# EAGLE design display (EAGLE 7.7.0)
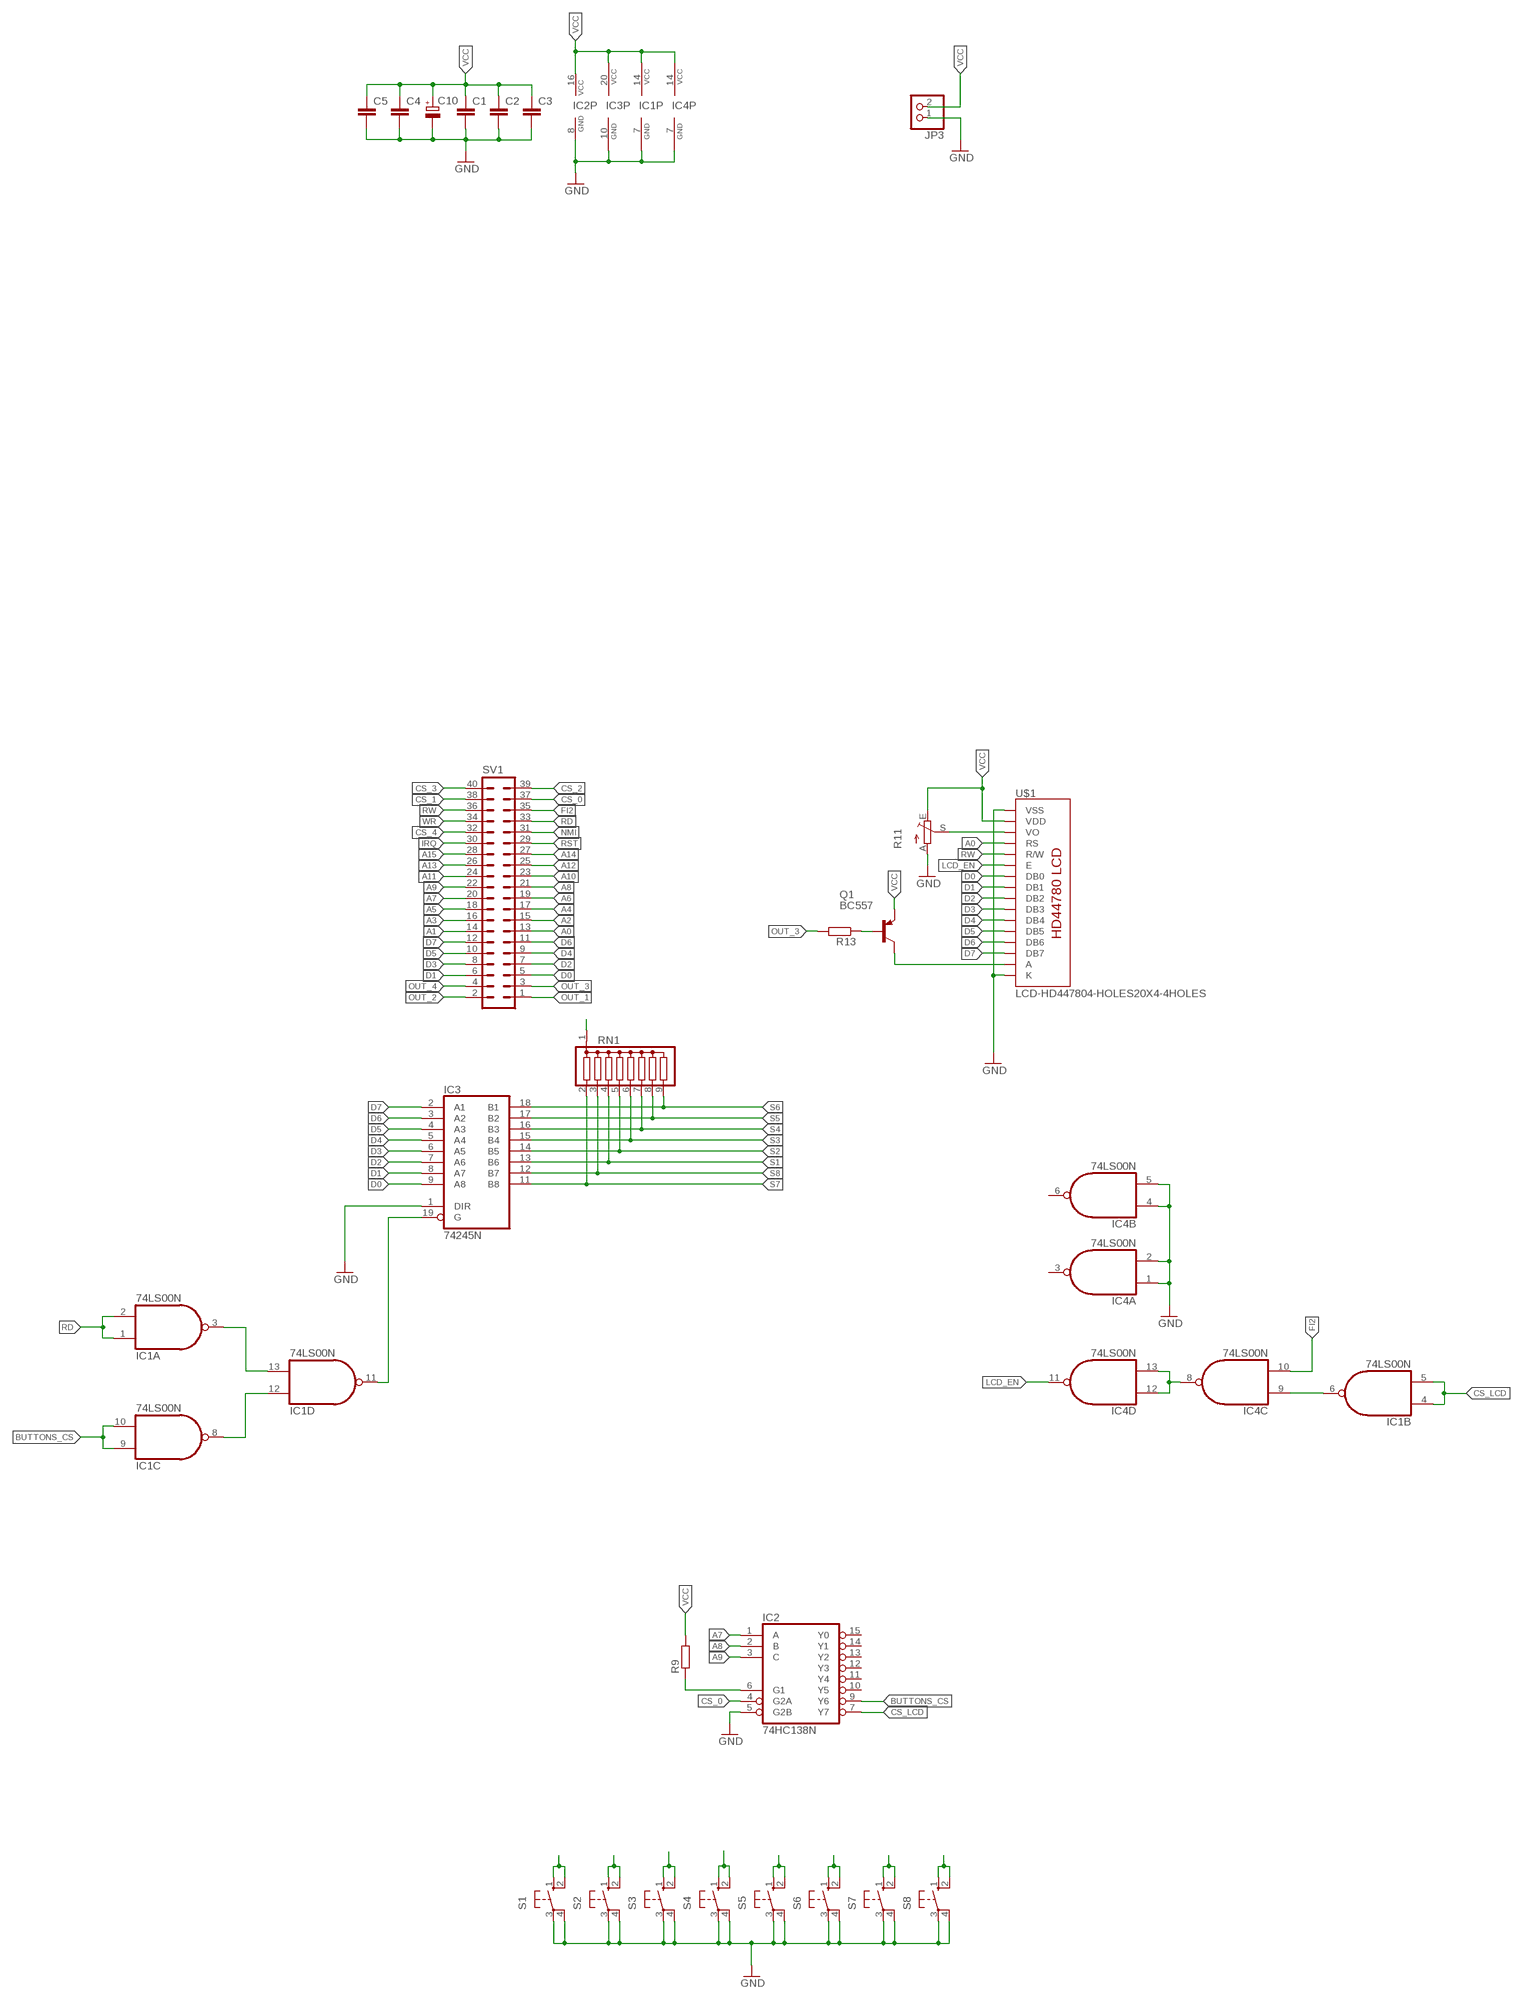
[diagram p0: schematic, sheet 1]

## Parts
C1  C-EUC0603  [C0603]
C2  C-EUC1206  [C1206]
C3  C-EUC1206  [C1206]
C4  C-EUC1206  [C1206]
C5  C-EUC1206  [C1206]
C10  CPOL-EUE5-10.5  [E5-10,5]
IC1  74LS00N  [DIL14]
IC2  74HC138N  [DIL16]
IC3  74245N  74LS245N  [DIL20]
IC4  74LS00N  [DIL14]
JP3  PINHD-1X2/90  [1X02/90]
Q1  BC557  [TO92]
R9  R-EU_0204/7  [0204/7]
R11  TRIM_EU-B25U  [B25U]
R13  R-EU_0204/7  [0204/7]
RN1  G08R  [SIL9]
S1  40-XX  [B3F-40XX]
S2  40-XX  [B3F-40XX]
S3  40-XX  [B3F-40XX]
S4  40-XX  [B3F-40XX]
S5  40-XX  [B3F-40XX]
S6  40-XX  [B3F-40XX]
S7  40-XX  [B3F-40XX]
S8  40-XX  [B3F-40XX]
SV1  ML40L  [ML40L]
U$1  LCD-HD447804-HOLES20X4-4HOLES  [LCD-20X4-4HOLES]

## Nets
A0: SV1.13 U$1.P$4(RS)
A1: SV1.14
A2: SV1.15
A3: SV1.16
A4: SV1.17
A5: SV1.18
A6: SV1.19
A7: IC2.1(A) SV1.20
A8: IC2.2(B) SV1.21
A9: IC2.3(C) SV1.22
A10: SV1.23
A11: SV1.24
A12: SV1.25
A13: SV1.26
A14: SV1.27
A15: SV1.28
BUTTONS_CS: IC1.9(C:I0) IC1.10(C:I1) IC2.9(Y6)
CS_0: IC2.4(G2A) SV1.37
CS_1: SV1.38
CS_2: SV1.39
CS_3: SV1.40
CS_4: SV1.32
CS_LCD: IC1.4(B:I0) IC1.5(B:I1) IC2.7(Y7)
D0: IC3.9(A8) SV1.5 U$1.P$7(DB0)
D1: IC3.8(A7) SV1.6 U$1.P$8(DB1)
D2: IC3.7(A6) SV1.7 U$1.P$9(DB2)
D3: IC3.6(A5) SV1.8 U$1.P$10(DB3)
D4: IC3.5(A4) SV1.9 U$1.P$11(DB4)
D5: IC3.4(A3) SV1.10 U$1.P$12(DB5)
D6: IC3.3(A2) SV1.11 U$1.P$13(DB6)
D7: IC3.2(A1) SV1.12 U$1.P$14(DB7)
FI2: IC4.10(C:I1) SV1.35
GND: C1.2 C2.2 C3.2 C4.2 C5.2 C10.- IC1.7(P:GND) IC2.5(G2B) IC2.8(GND) IC3.1(DIR) IC3.10(GND) IC4.1(A:I0) IC4.2(A:I1) IC4.4(B:I0) IC4.5(B:I1) IC4.7(P:GND) JP3.1 R11.A S1.3(P) S1.4(P1) S2.3(P) S2.4(P1) S3.3(P) S3.4(P1) S4.3(P) S4.4(P1) S5.3(P) S5.4(P1) S6.3(P) S6.4(P1) S7.3(P) S7.4(P1) S8.3(P) S8.4(P1) U$1.P$1(VSS) U$1.P$16(K)
IRQ: SV1.30
LCD_EN: IC4.11(D:O) U$1.P$6(E)
N$1: IC1.11(D:O) IC3.19(G)
N$3: Q1.3(C) U$1.P$15(A)
N$4: IC4.8(C:O) IC4.12(D:I0) IC4.13(D:I1)
N$5: IC1.6(B:O) IC4.9(C:I0)
N$6: Q1.2(B) R13.1
N$10: IC1.3(A:O) IC1.13(D:I1)
N$11: IC1.8(C:O) IC1.12(D:I0)
N$12: IC2.6(G1) R9.1
N$14: R11.S U$1.P$3(VO)
NMI: SV1.31
OUT_1: SV1.1
OUT_2: SV1.2
OUT_3: R13.2 SV1.3
OUT_4: SV1.4
RD: IC1.1(A:I0) IC1.2(A:I1) SV1.33
RST: SV1.29
RW: SV1.36 U$1.P$5(R/W)
S1: IC3.13(B6) RN1.4 S1.1(S) S1.2(S1)
S2: IC3.14(B5) RN1.5 S2.1(S) S2.2(S1)
S3: IC3.15(B4) RN1.6 S3.1(S) S3.2(S1)
S4: IC3.16(B3) RN1.7 S4.1(S) S4.2(S1)
S5: IC3.17(B2) RN1.8 S5.1(S) S5.2(S1)
S6: IC3.18(B1) RN1.9 S6.1(S) S6.2(S1)
S7: IC3.11(B8) RN1.2 S7.1(S) S7.2(S1)
S8: IC3.12(B7) RN1.3 S8.1(S) S8.2(S1)
VCC: C1.1 C2.1 C3.1 C4.1 C5.1 C10.+ IC1.14(P:VCC) IC2.16(VCC) IC3.20(VCC) IC4.14(P:VCC) JP3.2 Q1.1(E) R9.2 R11.E RN1.1 U$1.P$2(VDD)
WR: SV1.34
Unconnected: IC2.10(Y5) IC2.11(Y4) IC2.12(Y3) IC2.13(Y2) IC2.14(Y1) IC2.15(Y0) IC4.3(A:O) IC4.6(B:O)

## Library data of the parts
C1-C5 = rcl:C-EU: CAPACITOR, European symbol
C10 = rcl:CPOL-EU: POLARIZED CAPACITOR, European symbol
IC1 IC4 = 74xx-us:74*00: Quad 2-input NAND gate
IC2 = 74xx-eu:74*138: 3-line to 8-line DECODER/DEMULTIPLEXER
IC3 = 74xx-us:74*245: Octal BUS TRANSCEIVER, 3-state
JP3 = pinhead:PINHD-1X2: PIN HEADER
Q1 = transistor-pnp:BC557: PNP Transistor
R9 R13 = rcl:R-EU_: RESISTOR, European symbol
R11 = pot:TRIM_EU-: POTENTIOMETER
RN1 = resistor-sil:G08R: SIL RESISTOR; OC_FARNELL: unknown; OC_NEWARK: unknown
S1-S8 = switch-omron:40-XX: OMRON SWITCH; MF: OMRON COMPONENTS USA; MPN: B3F-4000; OC_FARNELL: 176434; OC_NEWARK: 36K3105
SV1 = con-harting-ml:ML40: HARTING; OC_FARNELL: unknown; OC_NEWARK: unknown
U$1 = HD44780LCD:LCD-HD44780

## Board
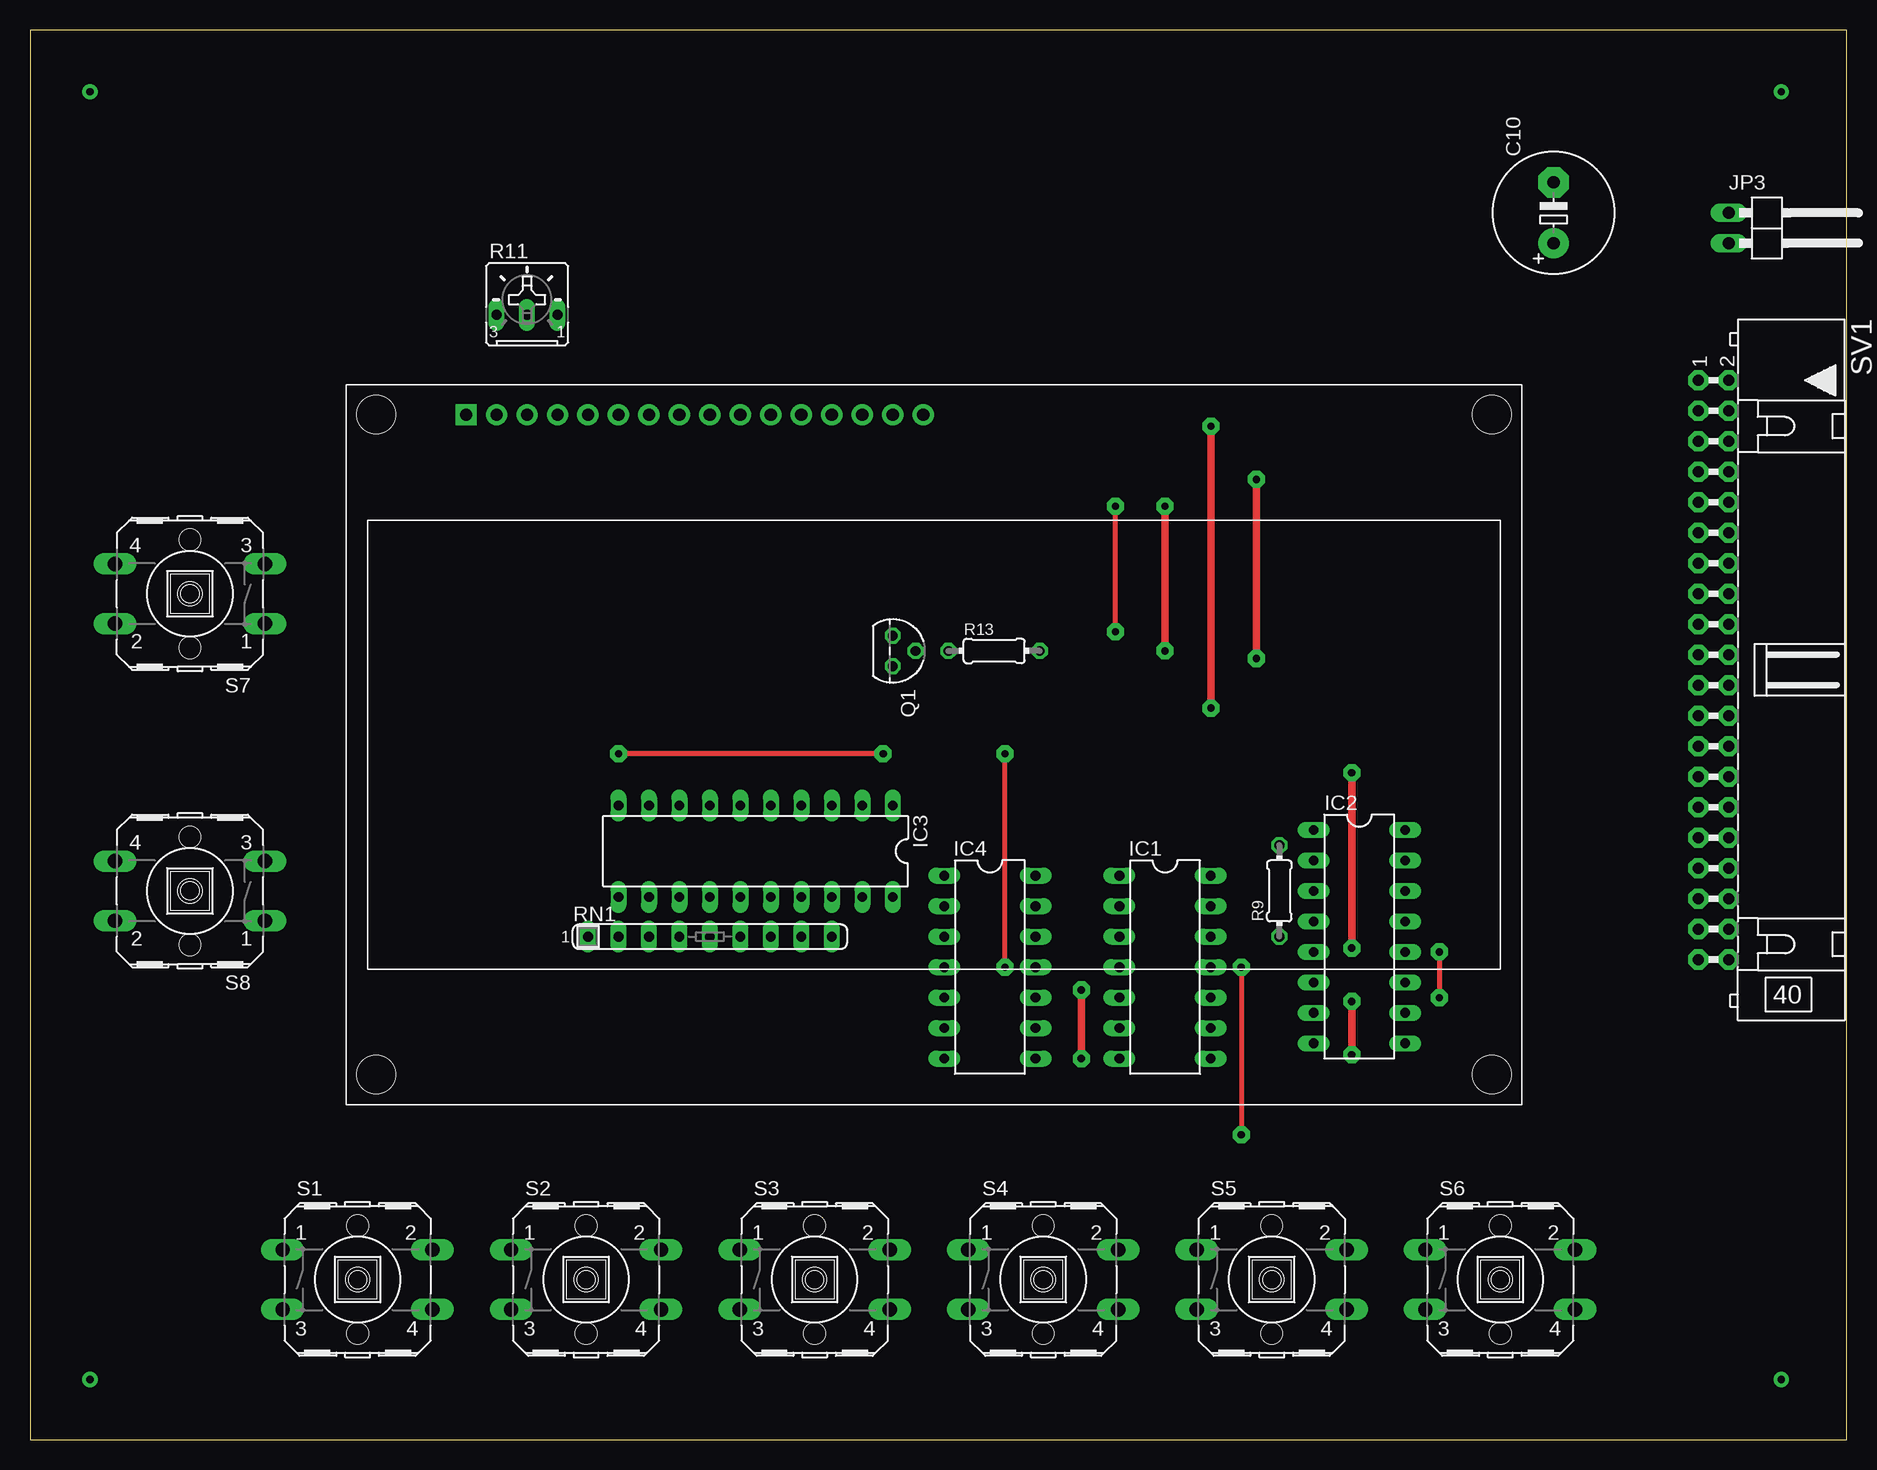
[diagram p1: board, top side]
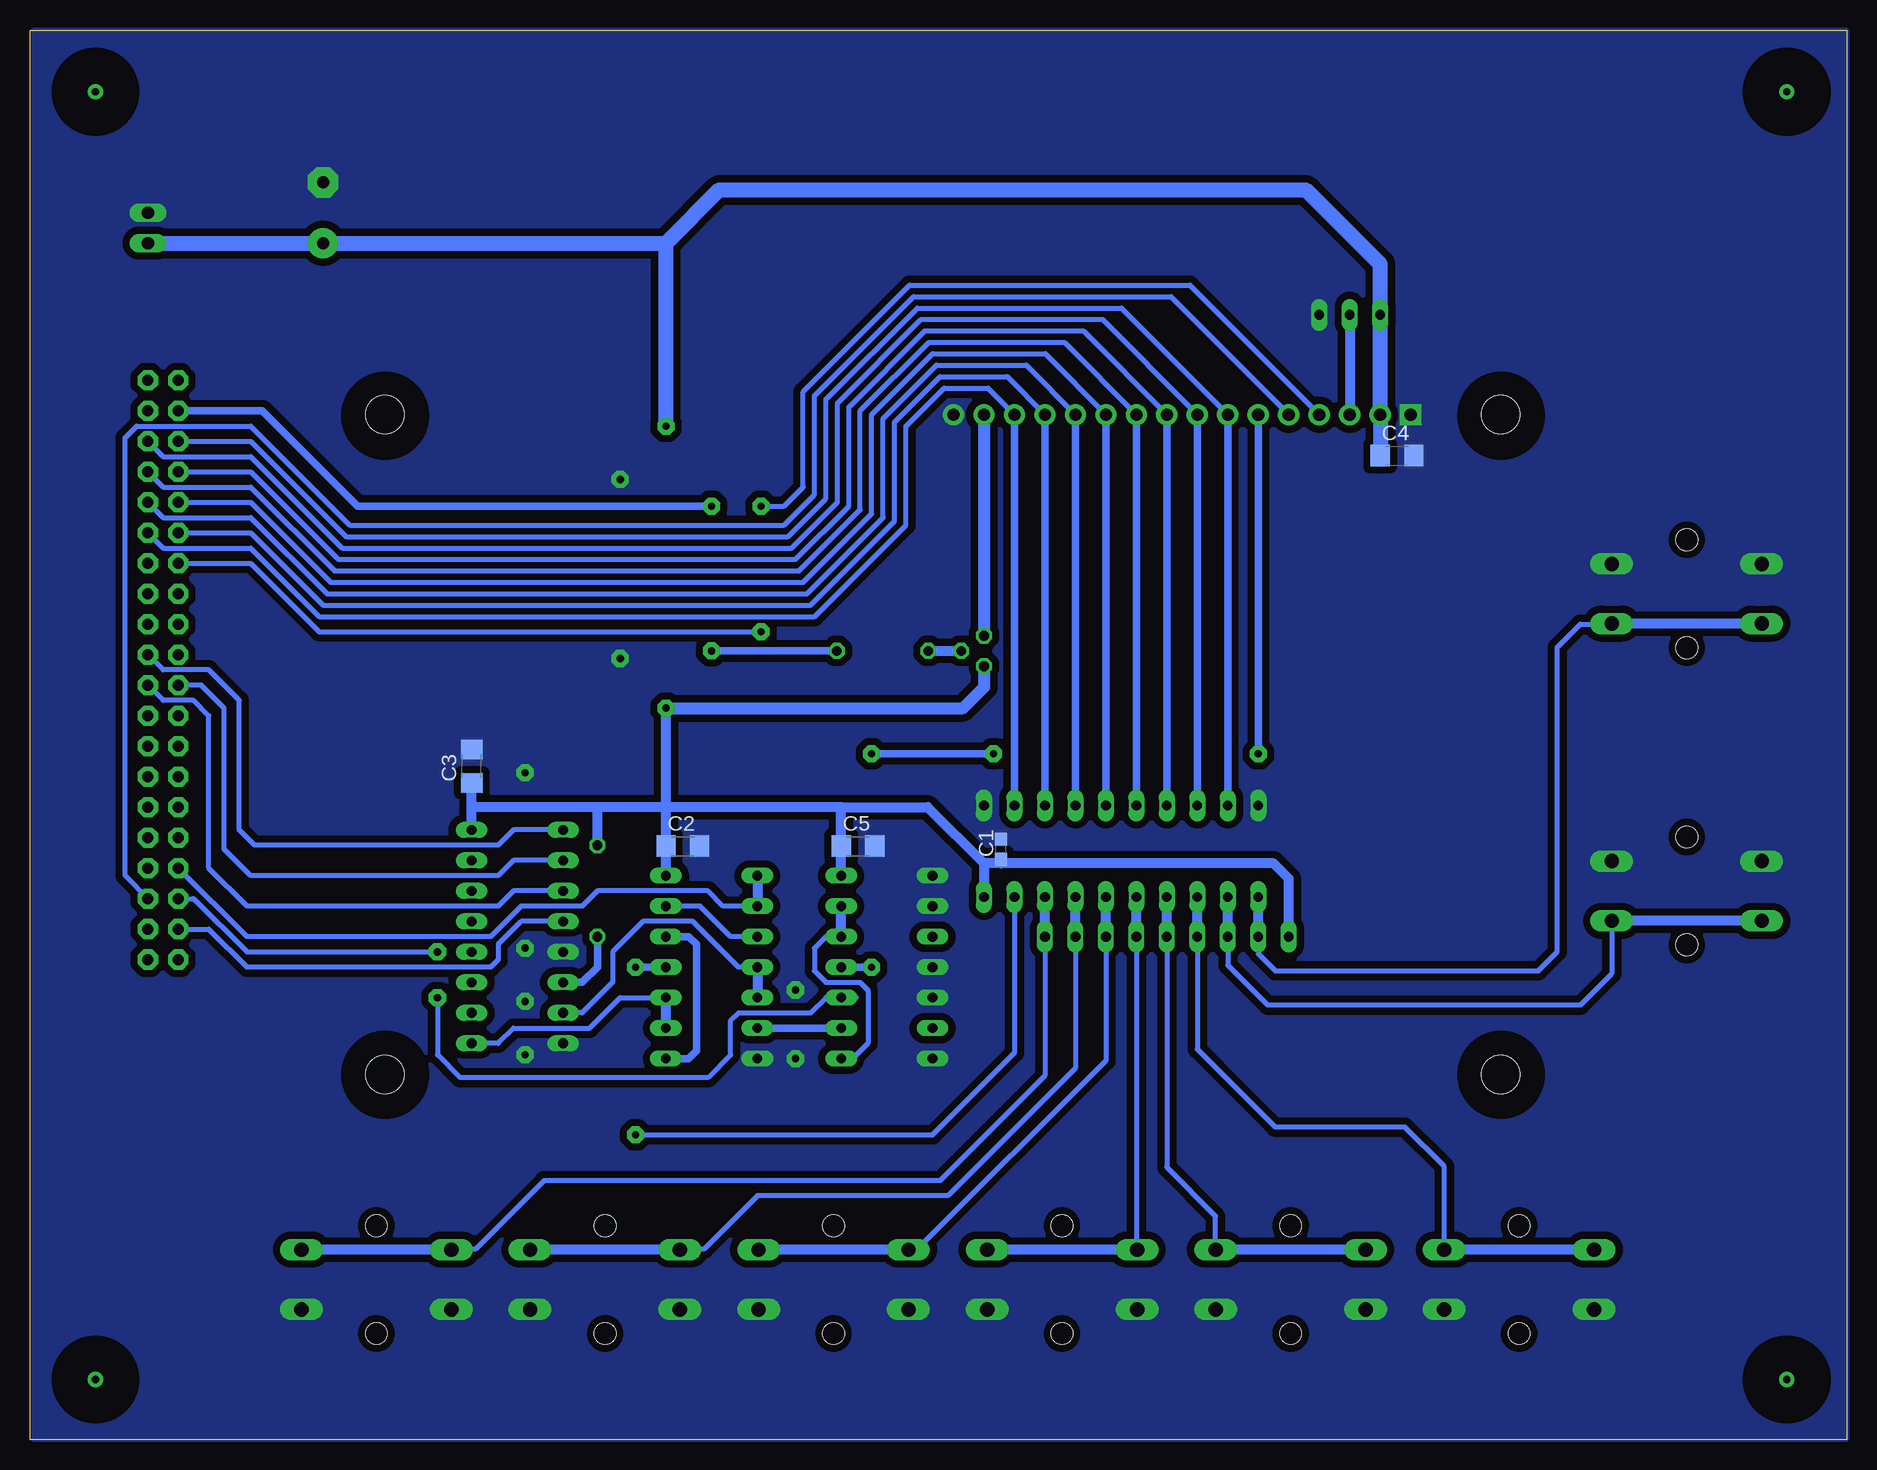
[diagram p2: board, bottom side, seen from below]

Size 151.44 x 117.47 mm. Coordinates in mm from the lower left corner, seen from the top.
Outline: 0,0 151.44,0 151.44,117.47 0,117.47 0,0
Copper layers (1*16): Top 0.035mm / dielectric 1.5mm / Bottom 0.035mm
Design rules "default *": minimum track width 10mil, minimum drill 24mil, track to track 8mil, track to pad 8mil, pad to pad 8mil, via to via 8mil, smd to smd 8mil, copper to edge 0mil, drill to drill 8mil, minimum pad ring 10mil, minimum via ring 8mil, stop-mask expansion 4mil, vias tented up to drill 0mil, thermal gap 10mil
bRestrict: area 2,2 to 8,8; area 2,109.3 to 8,115.4; area 142.9,2 to 149,8; area 142.9,109.3 to 149,115.4; area 25.8,27.4 to 31.9,33.4; area 118.8,27.4 to 124.9,33.4; area 118.8,82.3 to 124.9,88.4; area 25.8,82.3 to 31.9,88.4

### Footprints (pad centres in the part's own frame; a part is rotated, then mirrored left to right if it is on the bottom)
C0603 = smd 1.1 x 1: 1 -0.85,0; 2 0.85,0
C1206 = smd 1.6 x 1.8: 1 -1.4,0; 2 1.4,0
E5-10,5 = drill 1.016 pad 2.54: + -2.54,0 | drill 1.016 pad 2.54 octagon: - 2.54,0
DIL14 = drill 0.813 long: 1 -7.62,-3.81; 2 -5.08,-3.81; 3 -2.54,-3.81; 4 0,-3.81; 5 2.54,-3.81; 6 5.08,-3.81; 7 7.62,-3.81; 8 7.62,3.81; 9 5.08,3.81; 10 2.54,3.81; 11 0,3.81; 12 -2.54,3.81; 13 -5.08,3.81; 14 -7.62,3.81
DIL16 = drill 0.813 long: 1 -8.89,-3.81; 2 -6.35,-3.81; 3 -3.81,-3.81; 4 -1.27,-3.81; 5 1.27,-3.81; 6 3.81,-3.81; 7 6.35,-3.81; 8 8.89,-3.81; 9 8.89,3.81; 10 6.35,3.81; 11 3.81,3.81; 12 1.27,3.81; 13 -1.27,3.81; 14 -3.81,3.81; 15 -6.35,3.81; 16 -8.89,3.81
DIL20 = drill 0.813 long: 1 -11.43,-3.81; 2 -8.89,-3.81; 3 -6.35,-3.81; 4 -3.81,-3.81; 5 -1.27,-3.81; 6 1.27,-3.81; 7 3.81,-3.81; 8 6.35,-3.81; 9 8.89,-3.81; 10 11.43,-3.81; 11 11.43,3.81; 12 8.89,3.81; 13 6.35,3.81; 14 3.81,3.81; 15 1.27,3.81; 16 -1.27,3.81; 17 -3.81,3.81; 18 -6.35,3.81; 19 -8.89,3.81; 20 -11.43,3.81
1X02/90 = drill 1.016 long: 1 -1.27,-3.81; 2 1.27,-3.81
TO92 = drill 0.813 octagon: 1 1.27,0; 2 0,1.905; 3 -1.27,0
0204/7 = drill 0.813 octagon: 1 -3.81,0; 2 3.81,0
B25U = drill 0.813 long: A 2.54,-0.889; E -2.54,-0.889; S 0,-0.889
SIL9 = drill 0.813 long: 1 -10.16,0; 2 -7.62,0; 3 -5.08,0; 4 -2.54,0; 5 0,0; 6 2.54,0; 7 5.08,0; 8 7.62,0; 9 10.16,0
B3F-40XX = drill 1.194 long: 1 -6.248,2.489; 2 6.248,2.489; 3 -6.248,-2.489; 4 6.248,-2.489 | hole 1.803: 0,-4.496; 0,4.496
ML40L = drill 0.914 pad 1.676 octagon: 1 -24.13,-1.27; 2 -24.13,1.27; 3 -21.59,-1.27; 4 -21.59,1.27; 5 -19.05,-1.27; 6 -19.05,1.27; 7 -16.51,-1.27; 8 -16.51,1.27; 9 -13.97,-1.27; 10 -13.97,1.27; 11 -11.43,-1.27; 12 -11.43,1.27; 13 -8.89,-1.27; 14 -8.89,1.27; 15 -6.35,-1.27; 16 -6.35,1.27; 17 -3.81,-1.27; 18 -3.81,1.27; 19 -1.27,-1.27; 20 -1.27,1.27; 21 1.27,-1.27; 22 1.27,1.27; 23 3.81,-1.27; 24 3.81,1.27; 25 6.35,-1.27; 26 6.35,1.27; 27 8.89,-1.27; 28 8.89,1.27; 29 11.43,-1.27; 30 11.43,1.27; 31 13.97,-1.27; 32 13.97,1.27; 33 16.51,-1.27; 34 16.51,1.27; 35 19.05,-1.27; 36 19.05,1.27; 37 21.59,-1.27; 38 21.59,1.27; 39 24.13,-1.27; 40 24.13,1.27
LCD-20X4-4HOLES = drill 1.016 pad 1.778 square: P$1 10,57.5 | drill 1.016 pad 1.778: P$2 12.54,57.5; P$3 15.08,57.5; P$4 17.62,57.5; P$5 20.16,57.5; P$6 22.7,57.5; P$7 25.24,57.5; P$8 27.78,57.5; P$9 30.32,57.5; P$10 32.86,57.5; P$11 35.4,57.5; P$12 37.94,57.5; P$13 40.48,57.5; P$14 43.02,57.5; P$15 45.56,57.5; P$16 48.1,57.5 | hole 3.2: 2.5,2.5; 2.5,57.5; 95.5,57.5; 95.5,2.5

### Placement (x,y rotation side)
C1  70.48,49.19 90 bottom
C2  97.02,49.45 0 bottom
C3  114.62,56.11 90 bottom
C4  37.49,81.99 0 bottom
C5  82.42,49.45 0 bottom
C10  127,102.23 90 top
IC1  94.61,39.37 270 top
IC2  110.81,41.91 270 top
IC3  60.49,49.03 180 top
IC4  80.01,39.37 270 top
JP3  145.41,100.97 270 top
Q1  71.91,65.72 270 top
R9  104.14,45.72 90 top
R11  41.43,94.61 0 top
R13  80.37,65.72 0 top
RN1  56.68,41.91 0 top
S1  27.3,13.34 0 top
S2  46.35,13.34 0 top
S3  65.41,13.34 0 top
S4  84.45,13.34 0 top
S5  103.5,13.34 0 top
S6  122.56,13.34 0 top
S7  13.34,70.48 180 top
S8  13.34,45.72 180 top
SV1  140.34,64.14 270 top
U$1  26.35,27.91 0 top

### Tracks (layer width: path | path; a pad name or v marks a point on that pad's centre or on a via)
A0  (via drill 0.6 pad 1.42)
  Top 0.406: v90.49,67.31 v90.49,77.79
  Bottom 0.406: SV1.13 133.03,73.03 127.32,67.31 v90.49,67.31 | v90.49,77.79 88.58,77.79 87,79.38 87,87.31 78.11,96.2 54.73,96.2 U$1.P$4
A7
  Bottom 0.406: IC2.1 111.12,50.8 112.39,49.53 132.72,49.53 133.99,50.8 133.99,61.59 136.53,64.14 140.34,64.14 SV1.20
A8
  Bottom 0.406: IC2.2 111.12,48.26 112.39,46.99 133.03,46.99 135.25,49.21 135.25,60.96 137.16,62.87 SV1.21
A9
  Bottom 0.406: IC2.3 111.12,45.72 112.39,44.45 133.35,44.45 136.53,47.62 136.53,60.33 137.79,61.59 140.34,61.59 SV1.22
BUTTONS_CS
  Bottom 0.406: IC2.9 112.39,33.02 111.12,34.29 104.78,34.29 102.23,36.83 IC1.10
  Bottom 0.813: IC1.9 IC1.10
CS_0
  Bottom 0.406: IC2.4 110.49,43.18 112.39,41.27 112.39,40.01 113.03,39.37 133.35,39.37 136.53,42.55 SV1.37
CS_LCD
  Bottom 0.406: IC1.4 92.39,39.37 96.2,43.18 100.33,43.18 102.87,40.64 102.87,38.1 105.41,35.56 IC2.7
  Bottom 0.813: IC1.4 IC1.5
D0
  Bottom 0.406: SV1.5 133.03,83.19 125.09,75.25 88.27,75.25 85.09,78.42 85.09,86.68 77.47,94.3 60.45,94.3 51.99,85.81 U$1.P$7 51.59,85.44
  Bottom 0.61: IC3.9 U$1.P$7 51.99,85.81
D1
  Bottom 0.406: SV1.6 140.34,81.92 133.03,81.92 125.41,74.3 87.95,74.3 84.14,78.11 84.14,86.36 77.15,93.34 62.04,93.34 54.53,85.81 U$1.P$8 54.13,85.44
  Bottom 0.61: IC3.8 U$1.P$8 54.53,85.81
D2
  Bottom 0.406: SV1.7 133.03,80.64 125.73,73.34 87.63,73.34 83.19,77.79 83.19,86.04 76.83,92.39 63.62,92.39 U$1.P$9 56.67,85.44
  Bottom 0.61: U$1.P$9 IC3.7
D3
  Bottom 0.406: SV1.8 140.34,79.38 133.03,79.38 126.05,72.39 87.31,72.39 82.23,77.47 82.23,85.72 76.52,91.44 65.21,91.44 U$1.P$10 | 59.22,85.44 U$1.P$10 | U$1.P$10
  Bottom 0.61: IC3.6 U$1.P$10 59.61,85.81
D4
  Bottom 0.406: SV1.9 133.03,78.11 126.36,71.44 87,71.44 81.28,77.15 81.28,85.41 76.2,90.49 66.8,90.49 U$1.P$11 61.76,85.44
  Bottom 0.61: U$1.P$11 IC3.5
D5
  Bottom 0.406: SV1.10 140.34,76.83 133.03,76.83 126.68,70.48 86.68,70.48 80.33,76.83 80.33,85.09 75.88,89.53 68.39,89.53 U$1.P$12 64.3,85.44
  Bottom 0.61: IC3.4 U$1.P$12
D6
  Bottom 0.406: SV1.11 133.03,75.56 127,69.53 86.36,69.53 79.38,76.52 79.38,84.77 75.56,88.58 69.97,88.58 U$1.P$13 66.83,85.44
  Bottom 0.61: IC3.3 U$1.P$13
D7
  Bottom 0.406: SV1.12 140.34,74.3 133.03,74.3 127.32,68.58 86.04,68.58 78.42,76.2 78.42,84.45 75.25,87.63 71.56,87.63 U$1.P$14 69.38,85.44
  Bottom 0.61: IC3.2 U$1.P$14
FI2  (via drill 0.6 pad 1.42)
  Top 0.406: v117.47,40.64 v117.47,36.83
  Bottom 0.406: SV1.35 137.79,45.09 133.35,40.64 v117.47,40.64 | 82.55,36.83 IC4.10 85.09,36.83 86.36,35.56 92.39,35.56 93.03,34.92 93.03,32.07 94.93,30.16 115.57,30.16 117.47,32.07 v117.47,36.83
GND  (via drill 0.6 pad 1.42)
  Top 0.61: v102.23,80.01 v102.23,65.09 | v110.17,36.51 v110.17,32.07 | v87.63,31.75 v87.63,37.47 | v110.17,40.96 v110.17,55.56
  pour Bottom (isolate 0.61, no thermals): 0,117.47 0,0 151.13,0 151.13,117.47
LCD_EN  (via drill 0.6 pad 1.42)
  Top 0.406: v71.12,57.15 v49.05,57.15 | v81.28,39.37 v81.28,57.15
  Bottom 0.61: v49.05,57.15 U$1.P$6 | IC4.11 v81.28,39.37 | v71.12,57.15 v81.28,57.15
N$1  (via drill 0.6 pad 1.42)
  Top 0.406: v100.97,39.37 v100.97,25.4
  Bottom 0.406: v100.97,25.4 76.2,25.4 69.38,32.23 IC3.19
  Bottom 0.61: IC1.11 v100.97,39.37
N$3
  Bottom 1.016: U$1.P$15 Q1.3
N$4
  Bottom 0.406: IC4.12 85.09,41.91 86.04,40.96 86.04,39.05 85.09,38.1 82.23,38.1 81.6,37.47 81.6,33.02 82.87,31.75 IC4.8
  Bottom 0.813: IC4.12 IC4.13
N$5
  Bottom 0.61: IC1.6 IC4.9
N$6
  Bottom 0.813: R13.1 Q1.2
N$10
  Bottom 0.406: IC1.3 93.03,41.91 95.57,44.45 IC1.13
N$11
  Bottom 0.61: IC1.12 96.52,41.91 95.89,41.27 95.89,32.38 96.52,31.75 IC1.8
N$12
  Bottom 0.61: IC2.6 105.41,38.1 104.14,39.37 R9.1
N$14
  Bottom 0.813: R11.S U$1.P$3
N$23  (via drill 0.6 pad 1.27)
  other vias: 5,112.31
N$24  (via drill 0.6 pad 1.27)
  other vias: 145.97,5
N$25  (via drill 0.6 pad 1.27)
  other vias: 145.97,112.31
N$37  (via drill 0.6 pad 1.27)
  other vias: 5,5
OUT_3  (via drill 0.6 pad 1.42)
  Top 0.61: v94.61,77.79 v94.61,65.72
  Bottom 0.61: SV1.3 132.08,85.72 124.14,77.79 v94.61,77.79 | v94.61,65.72 R13.2
RD
  Bottom 0.406: IC1.2 93.66,44.45 94.93,45.72 104.14,45.72 105.41,44.45 110.49,44.45 113.03,41.91 133.35,41.91 SV1.33
  Bottom 0.813: IC1.1 IC1.2
RW
  Bottom 0.406: SV1.36 143.51,46.99 143.51,83.5 142.56,84.45 133.03,84.45 124.78,76.2 88.58,76.2 86.04,78.74 86.04,87 77.79,95.25 56.32,95.25 U$1.P$5
S1
  Bottom 0.406: S1.2 33.55,22.76 36.83,26.04 47.62,26.04 54.13,32.55 RN1.4
  Bottom 0.813: S1.1 S1.2 | RN1.4 IC3.13
S2
  Bottom 0.406: S2.2 52.6,18.63 56.67,22.7 RN1.5
  Bottom 0.813: S2.1 S2.2 | RN1.5 IC3.14
S3
  Bottom 0.406: 59.22,16.3 59.69,15.82 | RN1.6 59.22,15.88 S3.1
  Bottom 0.813: S3.1 59.69,15.82 S3.2 | RN1.6 IC3.15
S4
  Bottom 0.406: 78.11,15.93 S4.1 77.52,15.82 61.76,31.59 RN1.7
  Bottom 0.813: S4.1 S4.2 | RN1.7 IC3.16
S5
  Bottom 0.406: RN1.8 64.3,30.95 74.93,20.32 90.81,20.32 95.25,15.88 97.21,15.88 S5.1
  Bottom 0.813: S5.1 S5.2 | RN1.8 IC3.17
S6
  Bottom 0.406: RN1.9 66.83,30.32 75.56,21.59 108.58,21.59 114.3,15.88 116.26,15.88 S6.1
  Bottom 0.813: S6.1 S6.2 | RN1.9 IC3.18
S7
  Bottom 0.406: S7.1 20.9,67.94 22.23,67.94 24.13,66.04 24.13,40.64 25.72,39.05 47.62,39.05 49.05,40.48 RN1.2
  Bottom 0.813: S7.2 S7.1 | RN1.2 IC3.11
S8
  Bottom 0.406: RN1.3 51.59,39.53 48.26,36.2 22.23,36.2 19.58,38.84 S8.1
  Bottom 0.813: S8.2 S8.1 | RN1.3 IC3.12
VCC  (via drill 0.6 pad 1.42)
  Top 0.61: v98.42,60.96 v98.42,84.45
  Bottom 0.406: C2.1 98.42,49.52 98.42,49.53 | C1.1 70.48,48.01
  Bottom 0.813: 83.82,52.7 98.42,52.7 | 98.42,52.7 104.14,52.7 | 104.14,52.7 114.62,52.7 | R9.2 104.14,52.7 | IC2.16 114.62,52.7 | IC1.14 98.42,49.53 98.42,52.7 | 114.62,52.7 C3.1 | C4.1 38.89,81.92 | IC4.14 C5.1 | C5.1 83.82,52.7 | C5.1 | 71.92,48.01 70.48,48.01 47.78,48.01 46.51,46.74 RN1.1 | 71.92,48.01 IC3.20 | 83.82,52.7 76.61,52.7 71.92,48.01 | 98.42,52.7 v98.42,60.96
  Bottom 1.016: RN1.1 | v98.42,60.96 73.66,60.96 71.91,62.71 Q1.1
  Bottom 1.27: 38.89,81.92 U$1.P$2 R11.E 38.89,97.95 45.09,104.14 93.98,104.14 98.42,99.69 | JP3.2 C10.+ 98.42,99.69 | v98.42,84.45 98.42,99.69